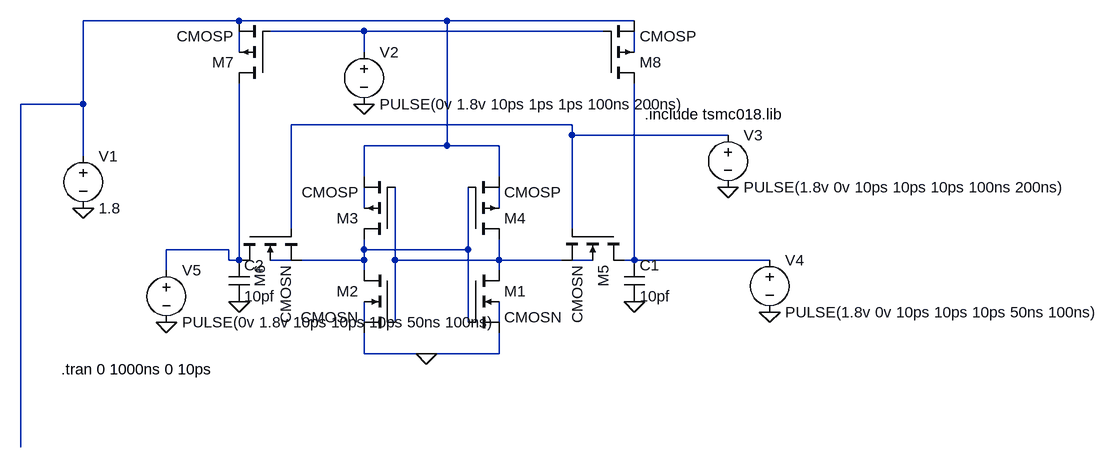
[diagram p0: schematic 6T_SRAM (1).asc]
6T_SRAM (1).asc, the LTspice schematic file:
Version 4
SHEET 1 1352 680
WIRE -64 -192 -304 -192
WIRE 256 -192 -64 -192
WIRE 544 -192 256 -192
WIRE 128 -176 -16 -176
WIRE 496 -176 128 -176
WIRE -64 -144 -64 -176
WIRE 128 -144 128 -176
WIRE 544 -144 544 -176
WIRE -304 -64 -304 -192
WIRE -304 -64 -400 -64
WIRE 448 -32 16 -32
WIRE 448 -16 448 -32
WIRE 688 -16 448 -16
WIRE 256 0 256 -192
WIRE 256 0 128 0
WIRE 336 0 256 0
WIRE -304 16 -304 -64
WIRE 128 48 128 0
WIRE 336 48 336 0
WIRE 128 96 128 64
WIRE 336 96 336 64
WIRE 16 128 16 -32
WIRE 448 128 448 -16
WIRE -80 160 -176 160
WIRE 128 160 128 144
WIRE 288 160 288 64
WIRE 288 160 128 160
WIRE -80 176 -80 160
WIRE -64 176 -64 -96
WIRE -64 176 -80 176
WIRE -48 176 -64 176
WIRE 16 176 -16 176
WIRE 128 176 128 160
WIRE 128 176 32 176
WIRE 176 176 176 64
WIRE 336 176 336 144
WIRE 336 176 176 176
WIRE 432 176 336 176
WIRE 480 176 448 176
WIRE 544 176 544 -96
WIRE 544 176 528 176
WIRE 752 176 544 176
WIRE -176 192 -176 160
WIRE 128 192 128 176
WIRE 336 192 336 176
WIRE 128 272 128 240
WIRE 176 272 176 176
WIRE 288 272 288 160
WIRE 336 272 336 240
WIRE 128 320 128 288
WIRE 224 320 128 320
WIRE 336 320 336 288
WIRE 336 320 224 320
WIRE -400 464 -400 -64
FLAG 224 320 0
FLAG 544 240 0
FLAG -64 240 0
FLAG -304 96 0
FLAG 128 -64 0
FLAG 688 64 0
FLAG 752 256 0
FLAG -176 272 0
SYMBOL cmosn 288 192 R0
SYMATTR InstName M1
SYMATTR Value2 l=0.18u w=0.36u
SYMBOL cmosn 176 192 M0
SYMATTR InstName M2
SYMATTR Value2 l=0.18u w=0.36u
SYMBOL cmosp 176 144 R180
SYMATTR InstName M3
SYMATTR Value2 l=0.18u w=0.18u
SYMBOL cmosp 288 144 M180
SYMATTR InstName M4
SYMATTR Value2 l=0.18u w=0.18u
SYMBOL cmosn 528 128 R90
SYMATTR InstName M5
SYMATTR Value2 l=0.18u w=0.18u
SYMBOL cmosn -64 128 M90
SYMATTR InstName M6
SYMATTR Value2 l=0.18u w=0.18u
SYMBOL cmosp -16 -96 R180
SYMATTR InstName M7
SYMATTR Value2 l=0.18u w=1.8u
SYMBOL cmosp 496 -96 M180
SYMATTR InstName M8
SYMATTR Value2 l=0.18u w=0.18u
SYMBOL cap 528 176 R0
SYMATTR InstName C1
SYMATTR Value 10pf
SYMBOL voltage -304 0 R0
WINDOW 123 0 0 Left 2
WINDOW 39 0 0 Left 2
SYMATTR InstName V1
SYMATTR Value 1.8
SYMBOL voltage 128 -160 R0
WINDOW 123 0 0 Left 2
WINDOW 39 0 0 Left 2
SYMATTR InstName V2
SYMATTR Value PULSE(0v 1.8v 10ps 1ps 1ps 100ns 200ns)
SYMBOL voltage 688 -32 R0
WINDOW 123 0 0 Left 2
WINDOW 39 0 0 Left 2
SYMATTR InstName V3
SYMATTR Value PULSE(1.8v 0v 10ps 10ps 10ps 100ns 200ns)
SYMBOL cap -80 176 R0
SYMATTR InstName C2
SYMATTR Value 10pf
SYMBOL voltage 752 160 R0
WINDOW 123 0 0 Left 2
WINDOW 39 0 0 Left 2
SYMATTR InstName V4
SYMATTR Value PULSE(1.8v 0v 10ps 10ps 10ps 50ns 100ns)
SYMBOL voltage -176 176 R0
WINDOW 123 0 0 Left 2
WINDOW 39 0 0 Left 2
SYMATTR InstName V5
SYMATTR Value PULSE(0v 1.8v 10ps 10ps 10ps 50ns 100ns)
TEXT 560 -48 Left 2 !.include tsmc018.lib
TEXT -338 344 Left 2 !.tran 0 1000ns 0 10ps

The netlist it stands for:
* 6T_SRAM (1).asc
M1 N011 N009 0 N015 CMOSN l=0.18u w=0.36u
M2 N009 N011 0 N014 CMOSN l=0.18u w=0.36u
M3 N009 N011 N001 N006 CMOSP l=0.18u w=0.18u
M4 N011 N009 N001 N007 CMOSP l=0.18u w=0.18u
M5 N013 N005 N011 N012 CMOSN l=0.18u w=0.18u
M6 N008 N005 N009 N010 CMOSN l=0.18u w=0.18u
M7 N008 N002 N001 N003 CMOSP l=0.18u w=1.8u
M8 N013 N002 N001 N004 CMOSP l=0.18u w=0.18u
C1 N013 0 10pf
V1 N001 0 1.8
V2 N002 0 PULSE(0v 1.8v 10ps 1ps 1ps 100ns 200ns)
V3 N005 0 PULSE(1.8v 0v 10ps 10ps 10ps 100ns 200ns)
C2 N008 0 10pf
V4 N013 0 PULSE(1.8v 0v 10ps 10ps 10ps 50ns 100ns)
V5 N008 0 PULSE(0v 1.8v 10ps 10ps 10ps 50ns 100ns)
.model NMOS NMOS
.model PMOS PMOS
.lib standard.mos
.include tsmc018.lib
.tran 0 1000ns 0 10ps
.backanno
.end